# EAGLE design VoltageSourcePCBV2 (EAGLE 9.4.2)
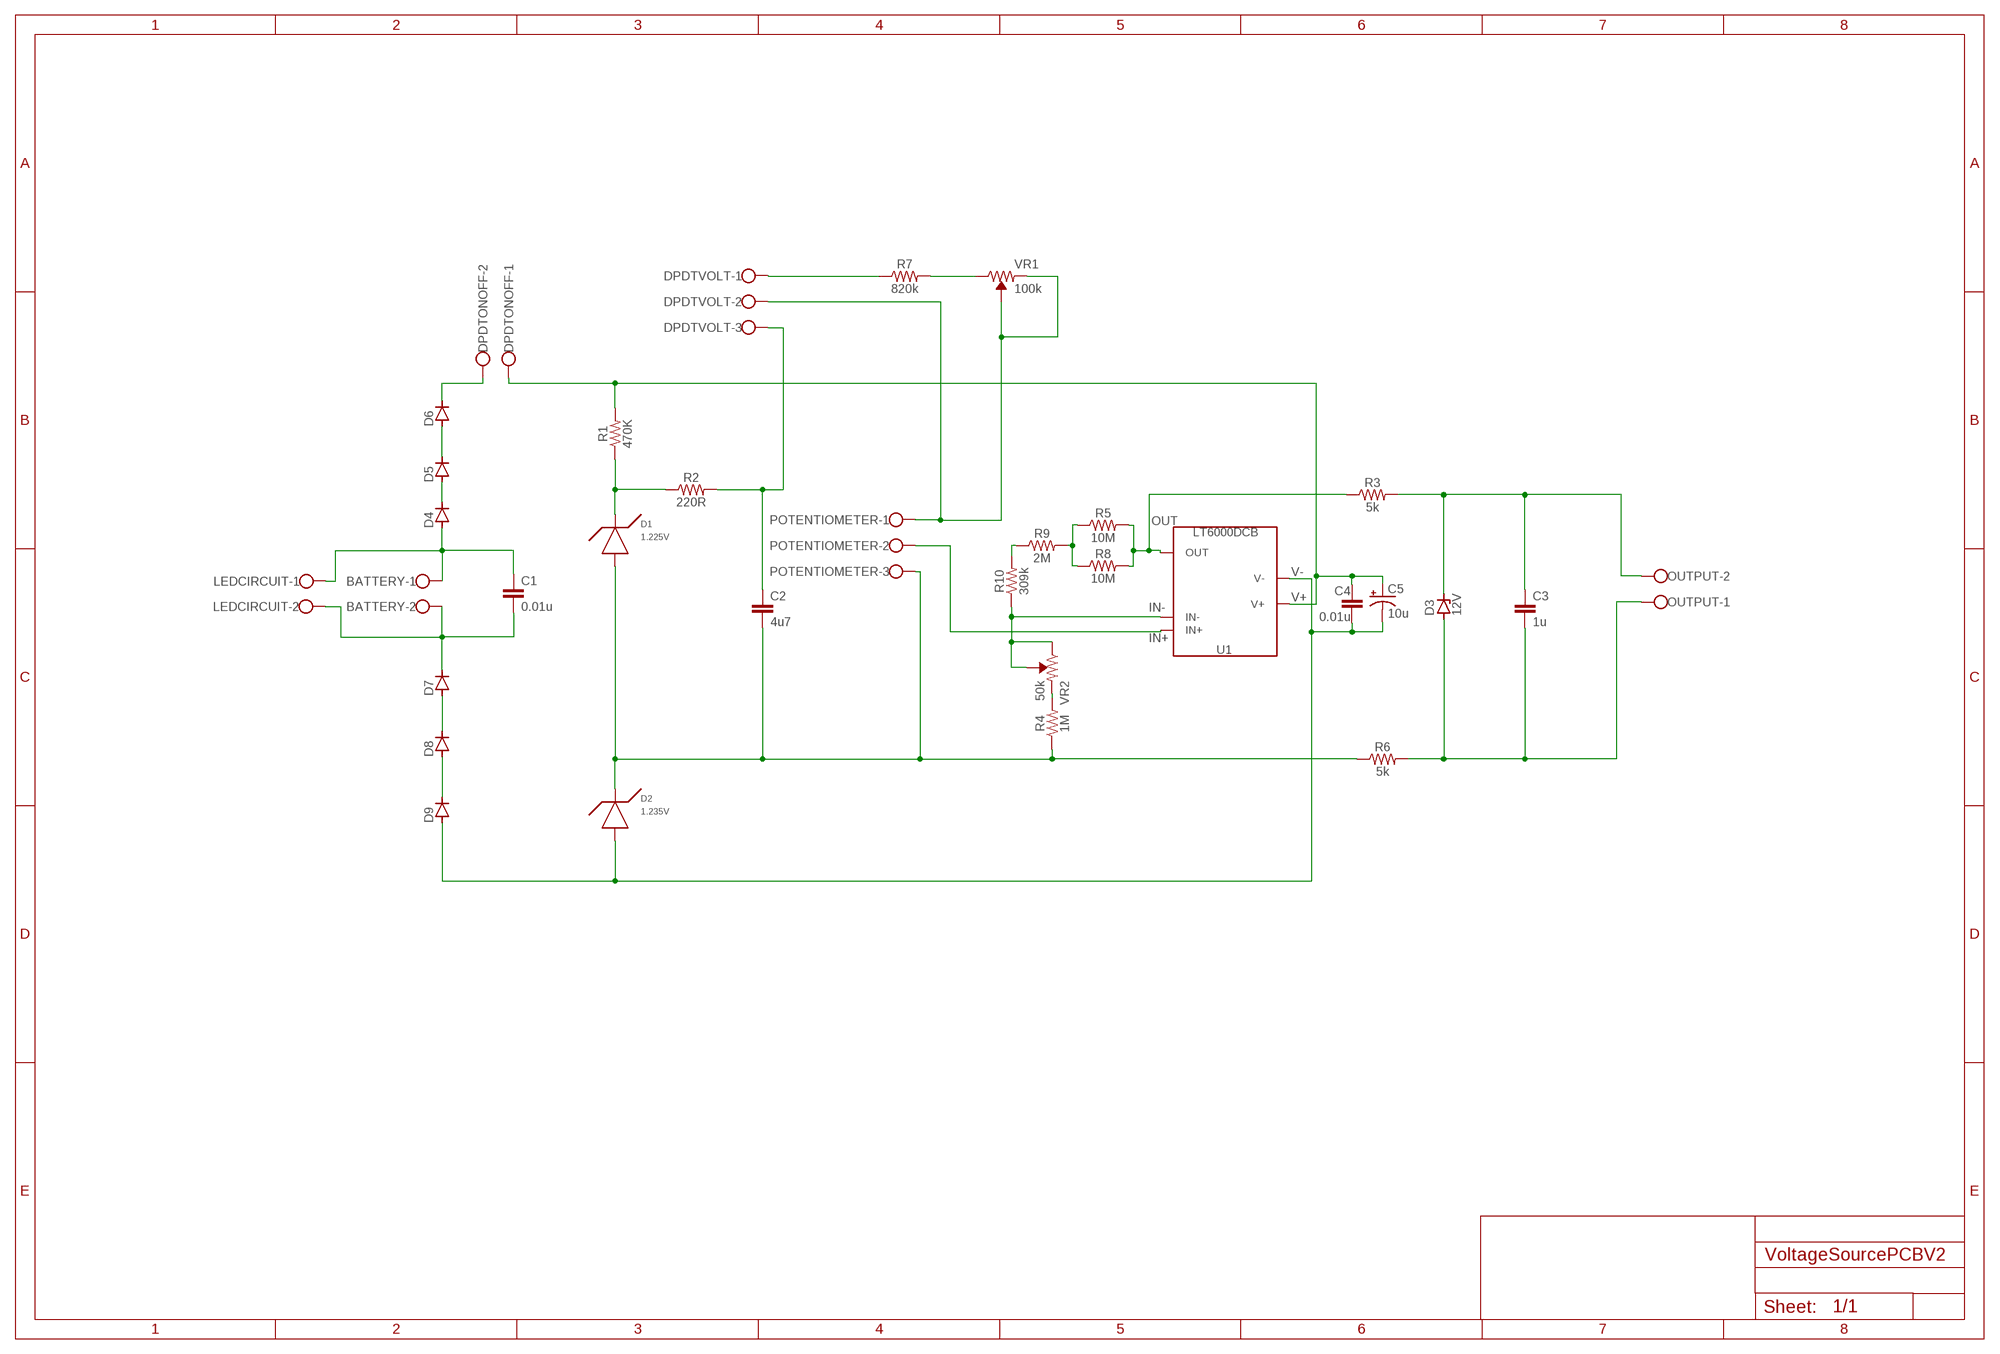
[diagram p0: schematic, sheet 1]

## Parts
BATTERY  W237-102  [W237-102]
C1  0.01u  0.33UF/330NF-0805-50V-10%  [0805]
C2  4u7  0.33UF/330NF-0805-50V-10%  [0805]
C3  1u  0.33UF/330NF-0805-50V-10%  [0805]
C4  0.01u  0.33UF/330NF-0805-50V-10%  [0805]
C5  10u  10UF-POLAR-EIA6032-25V-10%  [EIA6032-NOM]
D1  1.225V  LT1004CS8SMD  [S8PACKAGE]
D2  1.235V  LM385BDSMD  [SOIC-8PACKAGE]
D3  12V  ZENER-DIODESOT23  [SOT23]
D4  D-SOD123  [SOD123]
D5  D-SOD123  [SOD123]
D6  D-SOD123  [SOD123]
D7  D-SOD123  [SOD123]
D8  D-SOD123  [SOD123]
D9  D-SOD123  [SOD123]
DPDTONOFF  W237-102  [W237-102]
DPDTVOLT  W237-103  [W237-103]
LEDCIRCUIT  W237-102  [W237-102]
OUTPUT  W237-102  [W237-102]
POTENTIOMETER  W237-103  [W237-103]
R1  470K  RESISTOR0805  [0805]
R2  220R  RESISTOR0805  [0805]
R3  5k  RESISTOR0805  [0805]
R4  1M  RESISTOR0805  [0805]
R5  10M  RESISTOR0805  [0805]
R6  5k  RESISTOR0805  [0805]
R7  820k  RESISTOR0805  [0805]
R8  10M  RESISTOR0805  [0805]
R9  2M  RESISTOR0805  [0805]
R10  309k  RESISTOR0805  [0805]
U1  LT6000DCB  [LT6000]
VR1  100k  TRIMPOT-SMD-3MM-OPEN-1/10W-25%  [TRIMPOT-SMD-TC33X]
VR2  50k  TRIMPOT-SMD-3MM-OPEN-1/10W-25%  [TRIMPOT-SMD-TC33X]

## Nets
IN+: POTENTIOMETER.2 U1.3(IN+)
IN-: R10.1 U1.2(IN-) VR2.1(CW) VR2.2(WIPER)
N$1: BATTERY.2 C1.2 D7.1(C) LEDCIRCUIT.2
N$2: D6.1(C) DPDTONOFF.2
N$4: D4.1(C) D5.2(A)
N$5: D5.1(C) D6.2(A)
N$6: D1.6(CATHODE) D1.8(CATHODE) R1.1 R2.1
N$7: C2.2 D1.4(ANODE) D2.8(CATHODE) POTENTIOMETER.3 R4.1 R6.1
N$8: C2.1 DPDTVOLT.3 R2.2
N$9: D7.2(A) D8.1(C)
N$10: D8.2(A) D9.1(C)
N$11: DPDTVOLT.2 POTENTIOMETER.1 VR1.2(WIPER) VR1.3(CCW)
N$12: DPDTVOLT.1 R7.1
N$14: BATTERY.1 C1.1 D4.2(A) LEDCIRCUIT.1
N$15: R5.1 R8.1 R9.2
N$16: C3.1 D3.3(C) OUTPUT.2 R3.2
N$17: C3.2 D3.1(A) OUTPUT.1 R6.2
N$18: R4.2 VR2.3(CCW)
N$19: R7.2 VR1.1(CW)
N$20: R9.1 R10.2
OUT: R3.1 R5.2 R8.2 U1.4(OUT)
V+: C4.1 C5.A(+) DPDTONOFF.1 R1.2 U1.6(V+)
V-: C4.2 C5.C(-) D2.4(ANODE) D9.2(A) U1.5(V-) U1.7(V-)

## Library data of the parts
BATTERY DPDTONOFF LEDCIRCUIT OUTPUT = con-wago-500:W237-102: WAGO SCREW CLAMP; MPN: 237-102; OC_FARNELL: unknown; OC_NEWARK: 70K9898
C1-C4 = SparkFun-Capacitors:0.33UF/330NF: 0.33µF/330nF ceramic capacitors A capacitor is a passive two-terminal electrical component used to store electrical energy temporarily in an electric field.; PROD_ID: CAP-08469; VALUE: 0.33µF
C5 = SparkFun-Capacitors:10UF-POLAR: 10.0µF polarized capacitors A capacitor is a passive two-terminal electrical component used to store electrical energy temporarily in an electric field.; PROD_ID: CAP-12984; VALUE: 10µF
D1 = RequiredComponents:LT1004CS8: This is a micropower voltage reference (similar to zener diode) and is contained inside of an S8 package
D2 = RequiredComponents:LM385BD: This is a micropower voltage controller, which is similar to a zener diode, in a SOIC-8 package
D3 = diode:ZENER-DIODE: Z-Diode
D4-D9 = semicon-smd-ipc:D-: DIODE unfilled
DPDTVOLT POTENTIOMETER = con-wago-500:W237-103: WAGO SCREW CLAMP; MPN: 237-103; OC_FARNELL: unknown; OC_NEWARK: 18M7116
R1-R10 = SparkFun-Resistors:RESISTOR: Generic Resistor Package
U1 = RequiredComponents:LT6000: The LT6000 is a low noise, low current (16uA) op-amp, which takes a supply voltage of 16V.
VR1 VR2 = SparkFun-Resistors:TRIMPOT: Trimming Potentiometer (Trimpot) Three-terminal potentiometers, with an adjustable wiper and two adjustable resistors. A pot can be used to create a configurable voltage divider, or as a variable resistor. "Trimpots" are a subset of potentiometers, usually intended for "set-and-forget" applications. They're often more delicate than standard potentiometers - rated for fewer turns. Variants PTH-KNOB - PTH Trimpot w/ finger-adjustable knob Trimpot 10K with Knob <https://www.sparkfun.com/products/9806> (COM-09806) Datasheet <http://www.sparkfun.com/datasheets/Components/General/TSR-3386.pdf> SMD-3MM-CLOSED-FRAME - SMD 3mm Square Closed-Frame Trimpot Used on e.g. EasyDriver - Stepper Motor Driver <https://www.sparkfun.com/products/12779> Datasheet <http://www.bitechnologies.com/pdfs/22.pdf> (22AR10KTR) SMD-5MM - SMD 5mm Square Closed-Frame Trimpot Used on e.g. IOIO-OTG - V2.2 <https://www.sparkfun.com/products/13613> Datasheet <http://www.vishay.com/docs/51008/ts53.pdf> (TS53YL502MR10) SMD-3MM-1/10W-25% - 3mm Square Open-Frame Trimpot Used on e.g. SparkFun Shapeoko <https://www.sparkfun.com/products/13899> Datasheet <http://www.bourns.com/docs/Product-Datasheets/TC33.pdf> (TC33X-2-103E); PROD_ID: RES-12428, RES-08048; VALUE: 10k

## Board
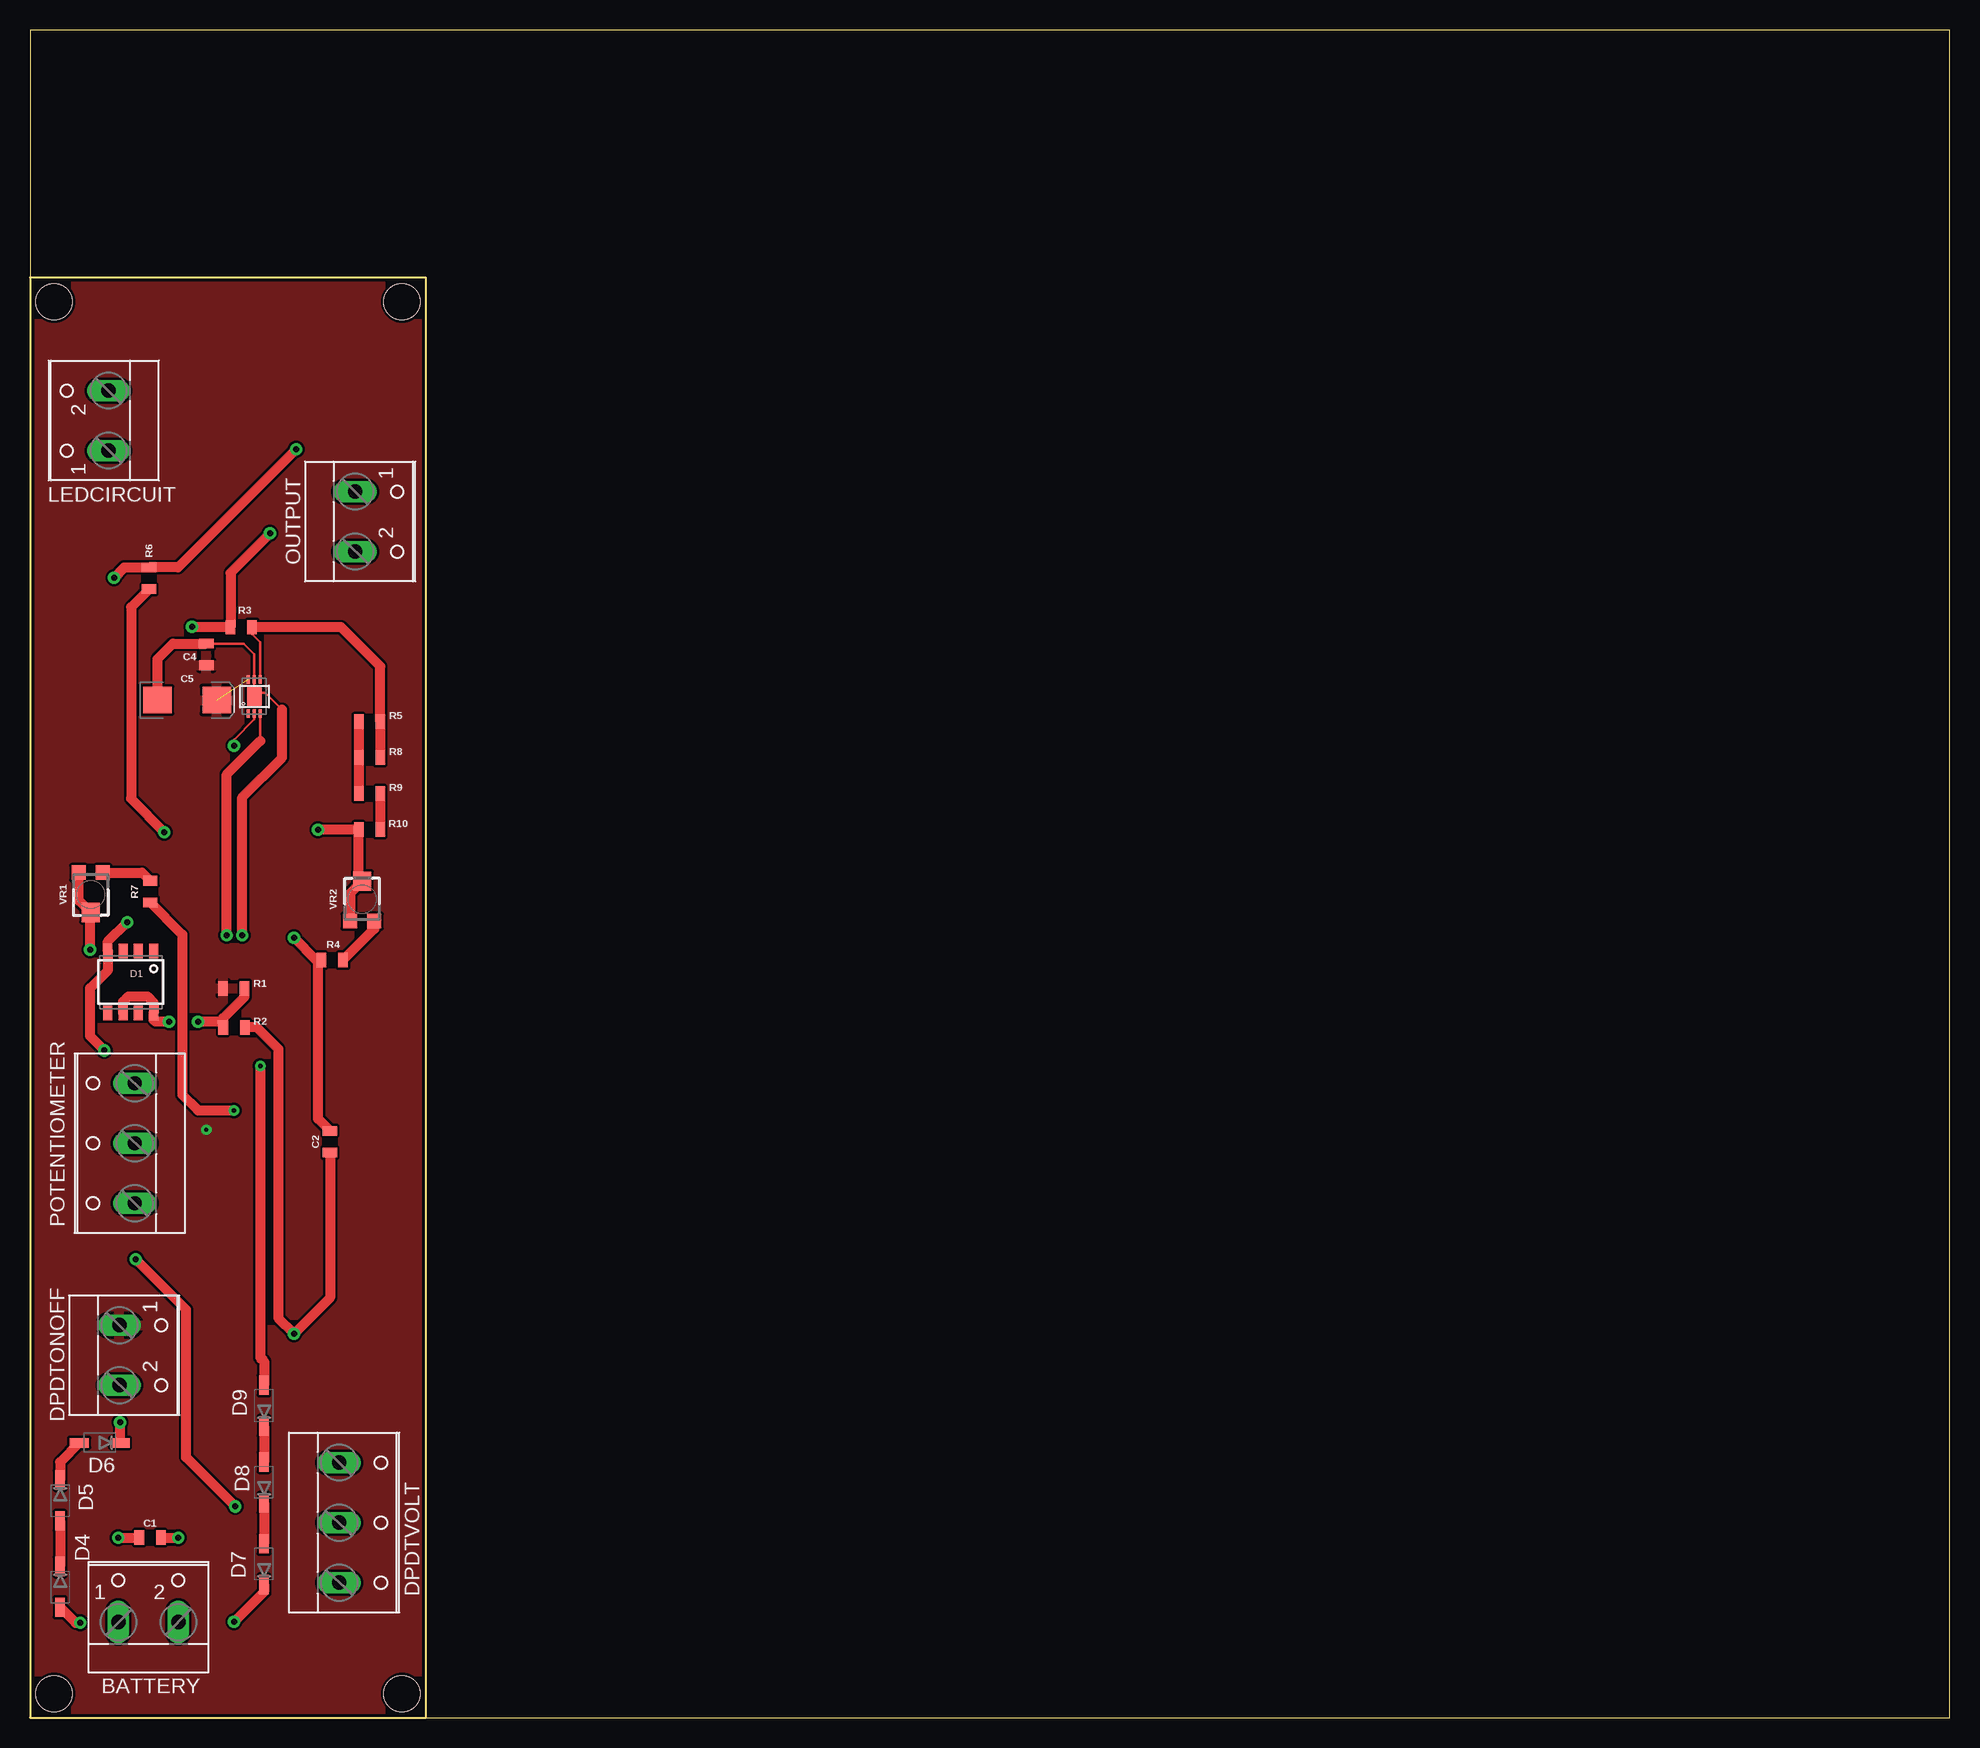
[diagram p1: board, top side]
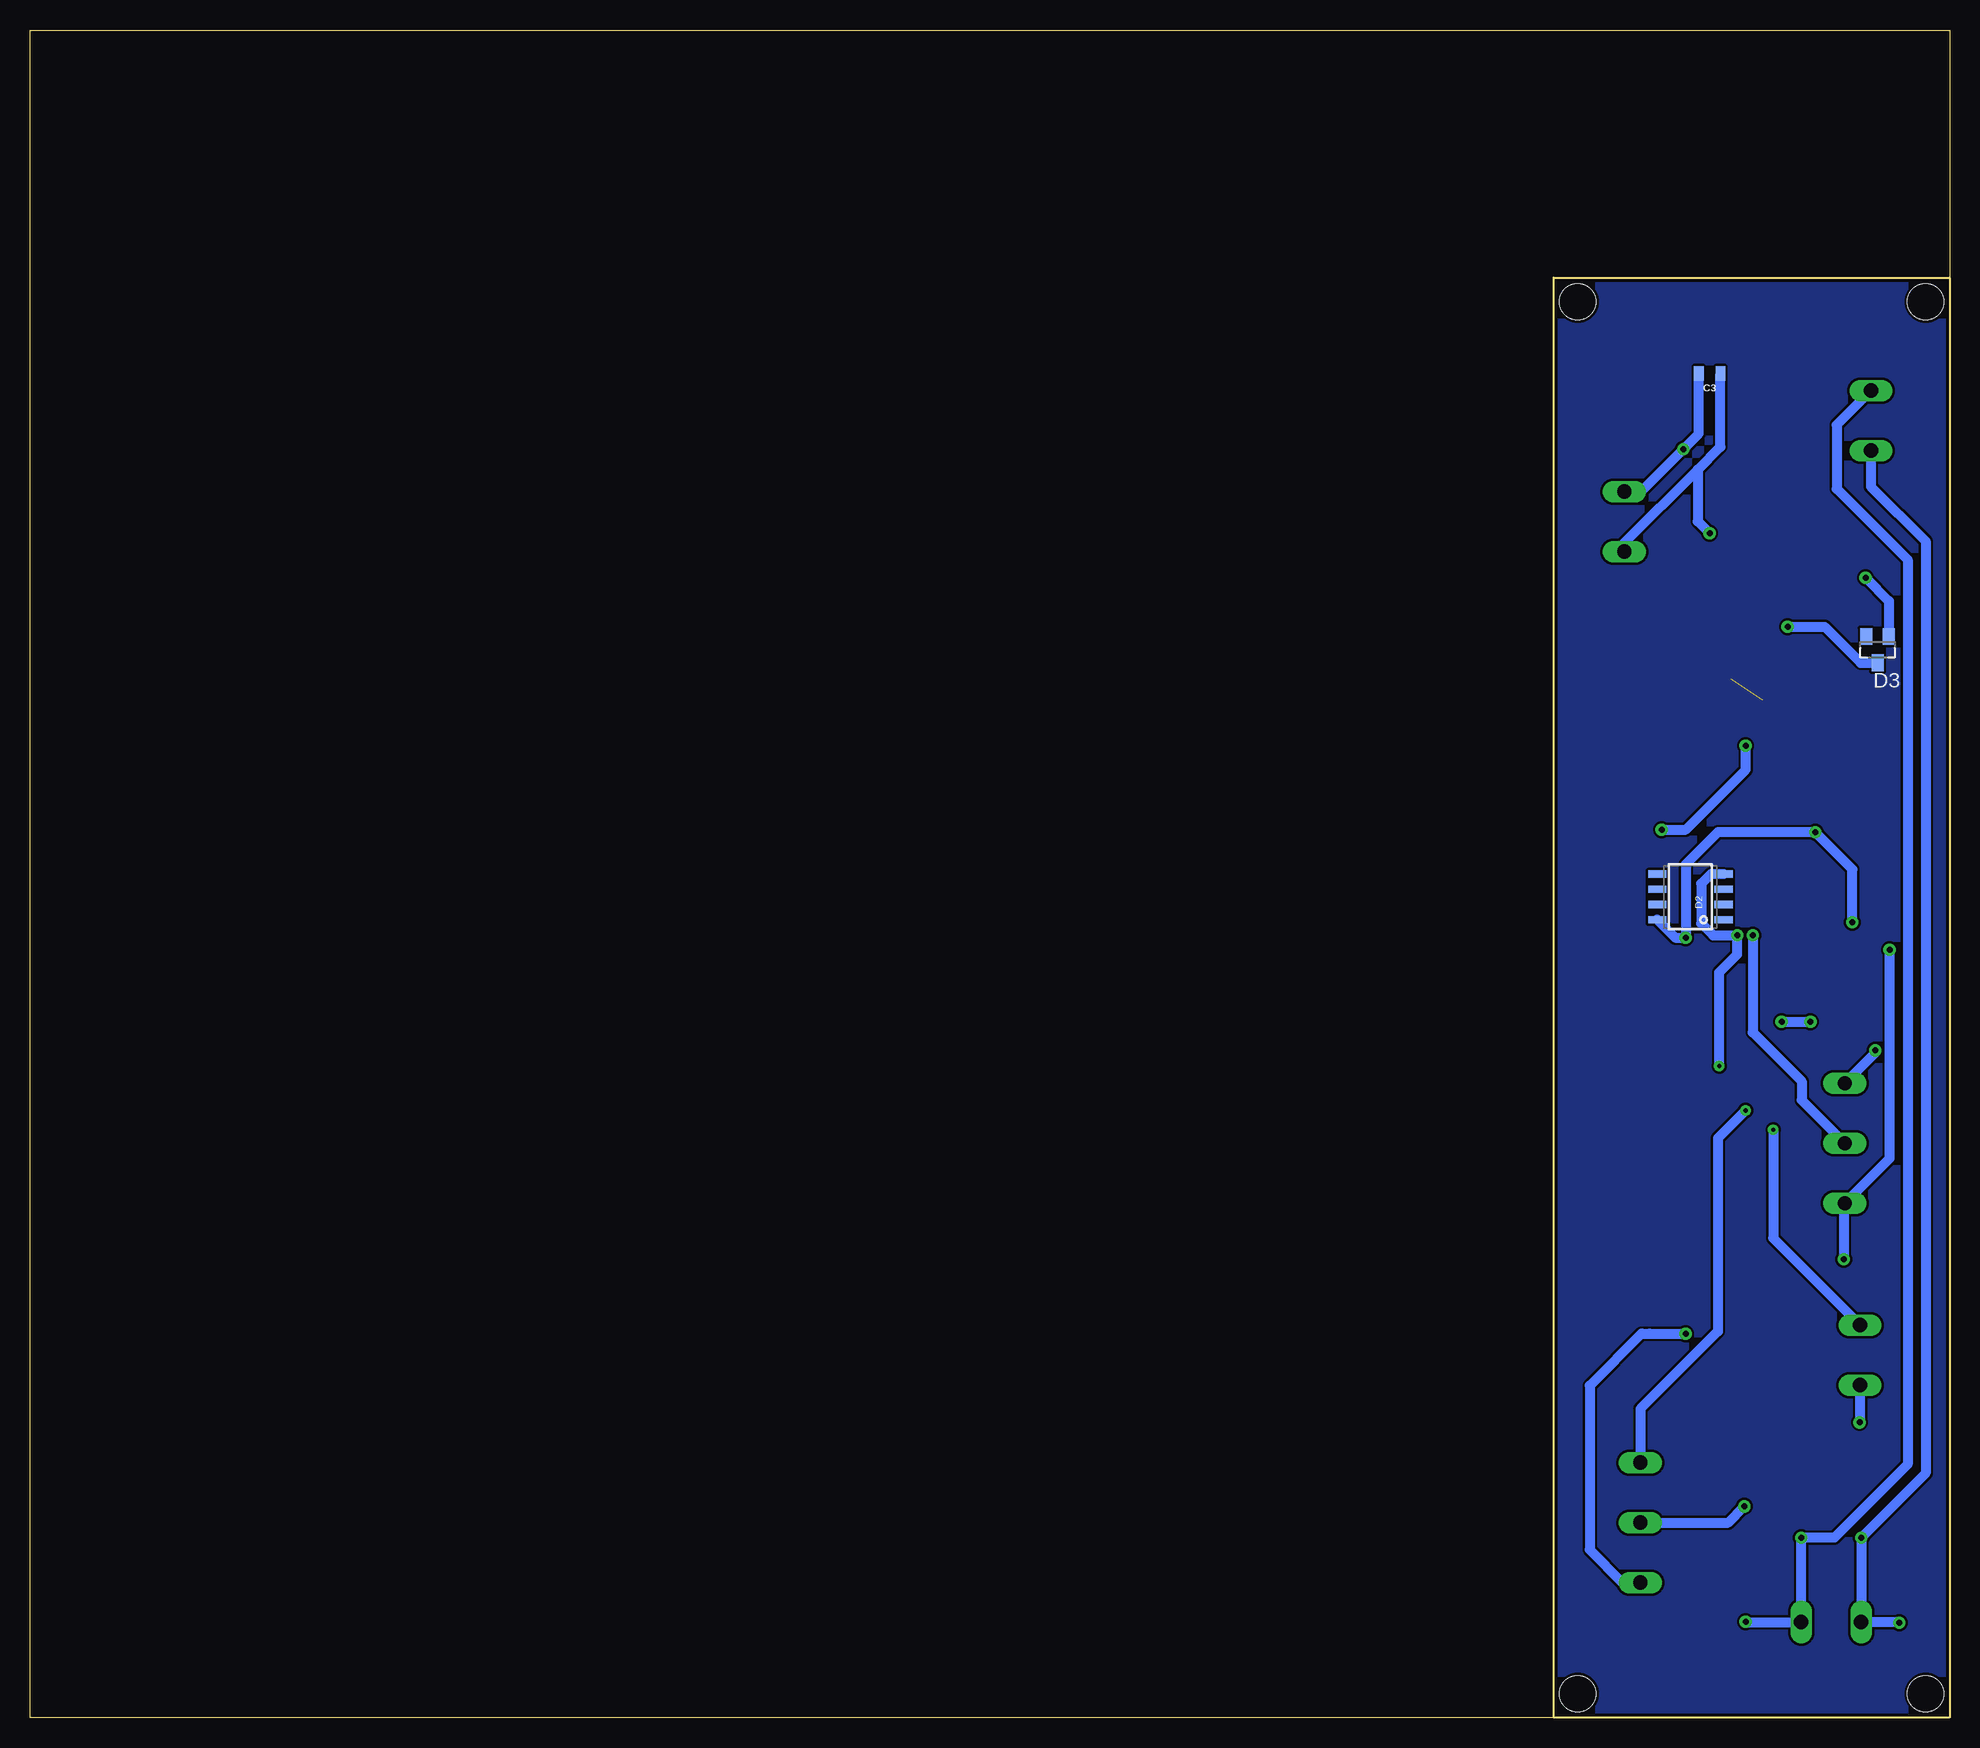
[diagram p2: board, bottom side, seen from below]

Size 160 x 140.64 mm. Coordinates in mm from the lower left corner, seen from the top.
Outline: 33,0 160,0 160,140.64 0,140.64 0,120
Outline: 33,0 33,120 0,120
Outline: 0,120 0,0 33,0
Copper layers (1*16): Top 0.035mm / dielectric 1.5mm / Bottom 0.035mm
Design rules "PCBTrain": minimum track width 8mil, minimum drill 0.2mm, track to track 8mil, track to pad 8mil, pad to pad 8mil, via to via 8mil, smd to smd 8mil, copper to edge 0.25mm, drill to drill 8mil, minimum pad ring 12mil, minimum via ring 10mil, stop-mask expansion 4mil, vias tented up to drill 20mil, thermal gap 10mil
Holes 3 mm at 2,2 31,2 2,118 31,118

### Footprints (pad centres in the part's own frame; a part is rotated, then mirrored left to right if it is on the bottom)
W237-102 = drill 1.194 long: 1 -2.5,-1.27; 2 2.5,-1.27
0805 = smd 0.8 x 1.2: 1 -0.9,0; 2 0.9,0
EIA6032-NOM = smd 2.37 x 2.23: A 2.47,0; C -2.47,0
S8PACKAGE = smd 0.75 x 1.2: 1 -1.905,-2.578; 2 -0.635,-2.578; 3 0.635,-2.578; 4 1.905,-2.578; 5 1.905,2.578; 6 0.635,2.578; 7 -0.635,2.578; 8 -1.905,2.578
SOIC-8PACKAGE = smd 0.6 x 1.52: 1 -1.905,-2.76; 2 -0.635,-2.76; 3 0.635,-2.76; 4 1.905,-2.76; 5 1.905,2.76; 6 0.635,2.76; 7 -0.635,2.76; 8 -1.905,2.76
SOT23 = smd 1 x 1.4: 1 -0.95,-1.1; 2 0.95,-1.1; 3 0,1.1
SOD123 = smd 1.6 x 0.8: 1 -1.7,0; 2 1.7,0
W237-103 = drill 1.194 long: 1 -5,-1.29; 2 0,-1.29; 3 5,-1.29
LT6000 = smd 0.25 x 0.7: 1 -0.5,-1.425; 2 0,-1.425; 3 0.5,-1.425; 4 0.5,1.425; 5 0,1.425; 6 -0.5,1.425 | smd 1.25 x 1.55: 7 0,0
TRIMPOT-SMD-TC33X = smd 1.2 x 1.2: 1 -1,-1.825; 3 1,-1.825 | smd 1.5 x 1.6: 2 0,1.5

### Placement (x,y rotation side)
BATTERY  9.87,9.23 0 top
C1  10,15 0 top
C2  25,48 90 top
C3  20,112 180 bottom
C4  14.7,88.6 90 top
C5  13.1,84.8 0 top
D1  8.4,61.3 180 top
D2  21.6,68.4 90 bottom
D3  6,89 180 bottom
D4  2.5,10.9 270 top
D5  2.5,18.1 270 top
D6  5.8,22.9 180 top
D7  19.5,12.8 90 top
D8  19.5,19.6 90 top
D9  19.5,26 90 top
DPDTONOFF  8.72,30.21 270 top
DPDTVOLT  27.06,16.26 270 top
LEDCIRCUIT  5.28,108.09 90 top
OUTPUT  28.38,99.68 270 top
POTENTIOMETER  7.44,47.87 90 top
R1  16.99,60.77 180 top
R2  17,57.53 0 top
R3  17.61,90.87 180 top
R4  25.18,63.13 0 top
R5  28.3,83 0 top
R6  9.92,94.95 90 top
R7  10.02,68.84 90 top
R8  28.3,80 0 top
R9  28.3,77 180 top
R10  28.3,74 0 top
U1  18.7,85.1 0 top
VR1  5.06,68.6 180 top
VR2  27.69,68.2 0 top

### Tracks (layer width: path | path; a pad name or v marks a point on that pad's centre or on a via)
GND
  pour Bottom: 0,120 33,120 33,0 0,0
IN+  (via drill 0.5)
  Top 0.203: 19.2,81.4 U1.3
  Top 0.813: 19.2,81.4 16.4,78.6 v16.4,65.2
  Bottom 0.813: v16.4,65.2 16.4,57.1 12.33,53.03 12.33,51.47 POTENTIOMETER.2
IN-  (via drill 0.5)
  Top 0.203: v17,81 17,81.5 18.7,83.2 U1.2
  Top 0.813: VR2.1 26.69,68.7 VR2.2 27.4,69.99 R10.1 v24,74
  Bottom 0.813: v24,74 22,74 17,79 v17,81
N$1  (via drill 0.5)
  Top 0.813: D7.1 19.5,10.5 v17,8 | C1.2 v12.37,15
  Bottom 0.813: v17,8 16.96,7.96 BATTERY.2 v12.37,15 9.6,15 3.5,21.1 3.5,96.5 9.4,102.4 9.4,107.74 LEDCIRCUIT.2
N$2  (via drill 0.5)
  Top 0.813: D6.1 v7.5,24.6
  Bottom 0.813: v7.5,24.6 7.45,24.65 DPDTONOFF.2
N$4
  Top 0.813: D5.2 D4.1
N$5
  Top 0.813: D6.2 2.5,21.3 D5.1
N$6  (via drill 0.5)
  Top 0.813: R2.1 16.1,58.3 | R1.1 17.89,60.09 16.1,58.3 | 16.1,58.3 15.8,58 v14,58 | v11.59,58 10.46,58 10.3,58.16 D1.8 10.3,59.59 9.79,60.1 8.2,60.1 7.76,59.66 D1.6
  Bottom 0.813: v14,58 v11.59,58
N$7  (via drill 0.5)
  Top 0.813: v22,65 23.87,63.13 R4.1 24,62.85 24,49.9 C2.2 | R6.1 8.42,92.55 8.42,76.58 v11.2,73.8 | v6.2,55.6 5,56.8 5,60.8 6.5,62.3 D1.4 6.5,64.69 v8.1,66.3
  Bottom 0.813: POTENTIOMETER.3 6.2,55.4 v6.2,55.6 | v8.1,66.3 8.1,70.7 v11.2,73.8 19.3,73.8 22,71.1 v22,65 22.86,65 D2.8
N$8  (via drill 0.5)
  Top 0.813: R2.2 18.9,57.53 20.7,55.73 20.7,33.3 v22,32 25,35 C2.1
  Bottom 0.813: DPDTVOLT.3 27.26,11.26 30,14 30,27.68 25.68,32 25.62,32 25,32 v22,32
N$9
  Top 0.813: D8.1 D7.2
N$10
  Top 0.813: D9.1 D8.2
N$11  (via drill 0.5)
  Top 0.813: v17.1,17.6 13,21.7 13,34 v8.8,38.2 | v5,64 5,67.04 VR1.2 4.06,68.1 VR1.3
  Bottom 0.813: DPDTVOLT.2 18.44,16.26 v17.1,17.6 | v8.8,38.2 8.8,42.8 POTENTIOMETER.1 5,46.6 v5,64
N$12  (via drill 0.35)
  Top 0.813: R7.1 12.7,65.26 12.7,51.9 14,50.6 v17,50.6
  Bottom 0.813: DPDTVOLT.1 25.77,25.73 19.3,32.2 19.3,48.3 v17,50.6
N$14  (via drill 0.5)
  Top 0.813: D4.2 3.8,7.9 v4.2,7.9 | v7.37,15 C1.1
  Bottom 0.813: LEDCIRCUIT.1 6.55,102.59 2,98.04 2,20.37 v7.37,15 BATTERY.1 4.26,7.96 v4.2,7.9
N$15
  Top 0.813: R9.2 R8.1 R5.1
N$16  (via drill 0.5)
  Top 0.813: v20,98.7 16.71,95.41 R3.2 16.68,90.9 v13.5,90.9
  Bottom 0.813: v13.5,90.9 10.4,90.9 7.4,87.9 D3.3 | 21,104 21,99.7 v20,98.7 | OUTPUT.2 27.11,97.89 21,104 | 21,104 19.1,105.9 C3.1
N$17  (via drill 0.5)
  Top 0.813: v7,95 7.85,95.85 R6.2 12.35,95.85 v22.2,105.7
  Bottom 0.813: OUTPUT.1 25.72,102.18 v22.2,105.7 20.9,107 C3.2 | v7,95 5.05,93.05 D3.1
N$18
  Top 0.813: VR2.3 28.69,65.74 R4.2
N$19
  Top 0.813: VR1.1 9.34,70.42 R7.2
N$20
  Top 0.813: R9.1 R10.2
OUT
  Top 0.203: R3.1 18.51,90.29 19.2,89.6 U1.4
  Top 0.813: R3.1 25.93,90.87 29.2,87.6 R5.2 R8.2
V+  (via drill 0.35)  (1 unrouted)
  Bottom 0.813: v14.7,49 14.7,39.96 DPDTONOFF.1
  pour Top: 0,120 33,120 33,0 0,0
V-  (via drill 0.35, 0.5)
  Top 0.203: U1.7 18.6,85.2 18.7,85.3 18.7,85.4 | 18.7,85.4 U1.5 18.7,88.6 17.8,89.5 C4.2 | 18.7,85.4 19.6,85.4 21,84
  Top 0.813: v17.7,65.2 17.7,76.7 21,80 21,84 | D9.2 19.5,29.7 19.2,30 v19.2,54.3 | C5.C 10.63,88.23 11.9,89.5 C4.2
  Bottom 0.813: D2.4 19.89,70.31 20.7,69.5 20.7,66.2 19.7,65.2 v17.7,65.2 17.7,63.6 19.2,62.1 v19.2,54.3